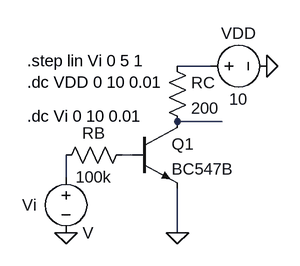
[diagram p0: schematic 2.2.1.charactristics.asc]
2.2.1.charactristics.asc, the LTspice schematic file:
Version 4
SHEET 1 880 680
WIRE 384 128 336 128
WIRE 400 208 336 208
WIRE 272 256 256 256
WIRE 176 288 176 256
WIRE 336 368 336 304
FLAG 176 368 0
FLAG 336 368 0
FLAG 464 128 0
SYMBOL Voltage 176 272 R0
WINDOW 0 -63 56 Left 2
SYMATTR InstName Vi
SYMBOL npn 272 208 R0
SYMATTR InstName Q1
SYMATTR Value BC547B
SYMBOL Voltage 368 128 R270
WINDOW 0 32 56 VTop 2
WINDOW 3 -32 56 VBottom 2
SYMATTR InstName VDD
SYMATTR Value 10
SYMBOL Res 320 112 R0
SYMATTR InstName RC
SYMATTR Value 200
SYMBOL Res 160 272 R270
WINDOW 0 32 56 VTop 2
WINDOW 3 0 56 VBottom 2
SYMATTR InstName RB
SYMATTR Value 100k
TEXT 120 200 Left 2 !.dc Vi 0 10 0.01
TEXT 120 120 Left 2 !.step lin Vi 0 5 1\n.dc VDD 0 10 0.01

The netlist it stands for:
* 2.2.1.charactristics.asc
Vi N004 0 V
Q1 N002 N003 0 0 BC547B
VDD N001 0 10
RC N001 N002 200
RB N004 N003 100k
.model NPN NPN
.model PNP PNP
.lib standard.bjt
.dc Vi 0 10 0.01
.step lin Vi 0 5 1
.dc VDD 0 10 0.01
.backanno
.end